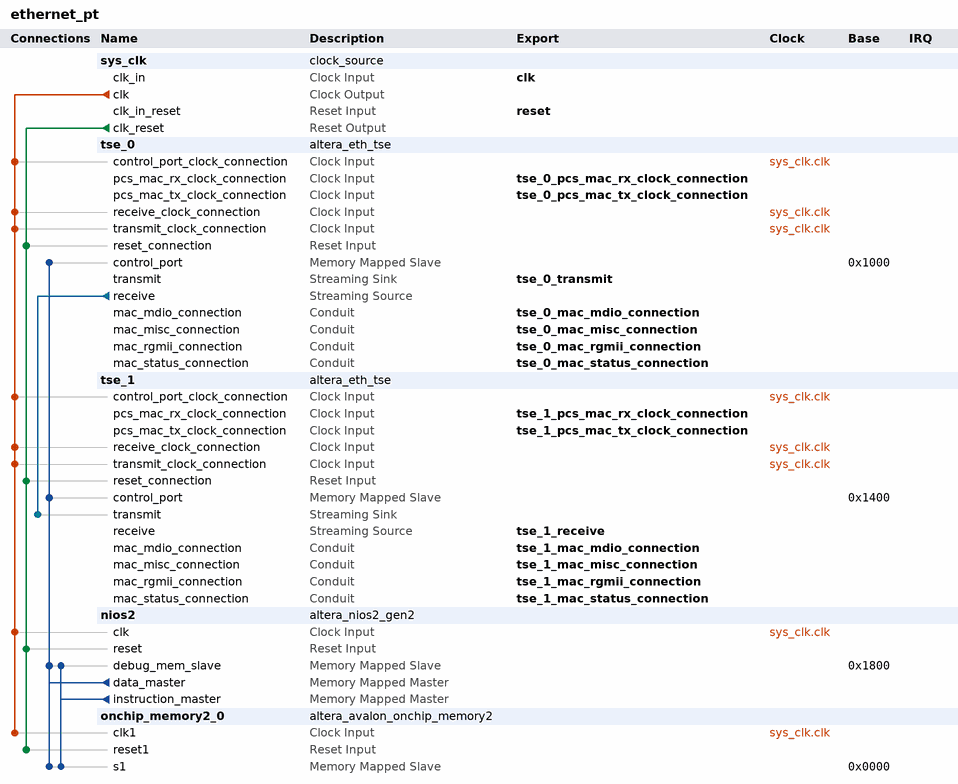
[diagram p0: system contents]
# Platform Designer (Qsys) system ethernet_pt, Cyclone IV E EP4CE115F29C7
# Parameters at their usual value, and those the tool derives, are not listed.
package require -exact qsys 18.1
create_system ethernet_pt
set_project_property DEVICE_FAMILY {Cyclone IV E}
set_project_property DEVICE EP4CE115F29C7

add_instance sys_clk clock_source 18.1
set_instance_parameter_value sys_clk clockFrequency 100000000

add_instance tse_0 altera_eth_tse 18.1
set_instance_parameter_value tse_0 XCVR_RCFG_JTAG_ENABLE 0
set_instance_parameter_value tse_0 XCVR_SET_CAPABILITY_REG_ENABLE 0
set_instance_parameter_value tse_0 XCVR_SET_CSR_SOFT_LOGIC_ENABLE 0
set_instance_parameter_value tse_0 XCVR_SET_PRBS_SOFT_LOGIC_ENABLE 0
set_instance_parameter_value tse_0 XCVR_SET_USER_IDENTIFIER 0
set_instance_parameter_value tse_0 core_variation SMALL_MAC_GIGE
set_instance_parameter_value tse_0 eg_addr 8
set_instance_parameter_value tse_0 enable_hd_logic false
set_instance_parameter_value tse_0 enable_mac_flow_ctrl false
set_instance_parameter_value tse_0 enable_magic_detect false
set_instance_parameter_value tse_0 enable_shift16 true
set_instance_parameter_value tse_0 ifGMII RGMII
set_instance_parameter_value tse_0 ing_addr 8
set_instance_parameter_value tse_0 mdio_clk_div 40
set_instance_parameter_value tse_0 stat_cnt_ena false
set_instance_parameter_value tse_0 transceiver_type NONE

add_instance tse_1 altera_eth_tse 18.1
set_instance_parameter_value tse_1 XCVR_RCFG_JTAG_ENABLE 0
set_instance_parameter_value tse_1 XCVR_SET_CAPABILITY_REG_ENABLE 0
set_instance_parameter_value tse_1 XCVR_SET_CSR_SOFT_LOGIC_ENABLE 0
set_instance_parameter_value tse_1 XCVR_SET_PRBS_SOFT_LOGIC_ENABLE 0
set_instance_parameter_value tse_1 XCVR_SET_USER_IDENTIFIER 0
set_instance_parameter_value tse_1 core_variation SMALL_MAC_GIGE
set_instance_parameter_value tse_1 eg_addr 8
set_instance_parameter_value tse_1 enable_hd_logic false
set_instance_parameter_value tse_1 enable_mac_flow_ctrl false
set_instance_parameter_value tse_1 enable_magic_detect false
set_instance_parameter_value tse_1 enable_shift16 true
set_instance_parameter_value tse_1 ifGMII RGMII
set_instance_parameter_value tse_1 ing_addr 8
set_instance_parameter_value tse_1 mdio_clk_div 40
set_instance_parameter_value tse_1 stat_cnt_ena false
set_instance_parameter_value tse_1 transceiver_type NONE

add_instance nios2 altera_nios2_gen2 18.1
set_instance_parameter_value nios2 dcache_size 2048
set_instance_parameter_value nios2 exceptionSlave onchip_memory2_0.s1
set_instance_parameter_value nios2 icache_size 4096
set_instance_parameter_value nios2 impl Tiny
set_instance_parameter_value nios2 resetSlave onchip_memory2_0.s1

add_instance onchip_memory2_0 altera_avalon_onchip_memory2 18.1
set_instance_parameter_value onchip_memory2_0 dataWidth 32
set_instance_parameter_value onchip_memory2_0 dualPort false
set_instance_parameter_value onchip_memory2_0 initMemContent true
set_instance_parameter_value onchip_memory2_0 initializationFileName onchip_mem.hex
set_instance_parameter_value onchip_memory2_0 memorySize 4096

# connections
add_connection sys_clk.clk nios2.clk clock
add_connection sys_clk.clk onchip_memory2_0.clk1 clock
add_connection sys_clk.clk tse_0.control_port_clock_connection clock
add_connection sys_clk.clk tse_0.receive_clock_connection clock
add_connection sys_clk.clk tse_0.transmit_clock_connection clock
add_connection sys_clk.clk tse_1.control_port_clock_connection clock
add_connection sys_clk.clk tse_1.receive_clock_connection clock
add_connection sys_clk.clk tse_1.transmit_clock_connection clock
add_connection sys_clk.clk_reset nios2.reset reset
add_connection sys_clk.clk_reset onchip_memory2_0.reset1 reset
add_connection sys_clk.clk_reset tse_0.reset_connection reset
add_connection sys_clk.clk_reset tse_1.reset_connection reset
add_connection nios2.data_master nios2.debug_mem_slave avalon
set_connection_parameter_value nios2.data_master/nios2.debug_mem_slave baseAddress 0x1800
add_connection nios2.data_master onchip_memory2_0.s1 avalon
set_connection_parameter_value nios2.data_master/onchip_memory2_0.s1 baseAddress 0x0000
add_connection nios2.data_master tse_0.control_port avalon
set_connection_parameter_value nios2.data_master/tse_0.control_port baseAddress 0x1000
add_connection nios2.data_master tse_1.control_port avalon
set_connection_parameter_value nios2.data_master/tse_1.control_port baseAddress 0x1400
add_connection nios2.instruction_master nios2.debug_mem_slave avalon
set_connection_parameter_value nios2.instruction_master/nios2.debug_mem_slave baseAddress 0x1800
add_connection nios2.instruction_master onchip_memory2_0.s1 avalon
set_connection_parameter_value nios2.instruction_master/onchip_memory2_0.s1 baseAddress 0x0000
add_connection tse_0.receive tse_1.transmit avalon_streaming

# exported interfaces
add_interface clk clock sink
set_interface_property clk EXPORT_OF sys_clk.clk_in
add_interface reset reset sink
set_interface_property reset EXPORT_OF sys_clk.clk_in_reset
add_interface tse_0_mac_mdio_connection conduit end
set_interface_property tse_0_mac_mdio_connection EXPORT_OF tse_0.mac_mdio_connection
add_interface tse_0_mac_misc_connection conduit end
set_interface_property tse_0_mac_misc_connection EXPORT_OF tse_0.mac_misc_connection
add_interface tse_0_mac_rgmii_connection conduit end
set_interface_property tse_0_mac_rgmii_connection EXPORT_OF tse_0.mac_rgmii_connection
add_interface tse_0_mac_status_connection conduit end
set_interface_property tse_0_mac_status_connection EXPORT_OF tse_0.mac_status_connection
add_interface tse_0_pcs_mac_rx_clock_connection clock sink
set_interface_property tse_0_pcs_mac_rx_clock_connection EXPORT_OF tse_0.pcs_mac_rx_clock_connection
add_interface tse_0_pcs_mac_tx_clock_connection clock sink
set_interface_property tse_0_pcs_mac_tx_clock_connection EXPORT_OF tse_0.pcs_mac_tx_clock_connection
add_interface tse_0_transmit avalon_streaming sink
set_interface_property tse_0_transmit EXPORT_OF tse_0.transmit
add_interface tse_1_mac_mdio_connection conduit end
set_interface_property tse_1_mac_mdio_connection EXPORT_OF tse_1.mac_mdio_connection
add_interface tse_1_mac_misc_connection conduit end
set_interface_property tse_1_mac_misc_connection EXPORT_OF tse_1.mac_misc_connection
add_interface tse_1_mac_rgmii_connection conduit end
set_interface_property tse_1_mac_rgmii_connection EXPORT_OF tse_1.mac_rgmii_connection
add_interface tse_1_mac_status_connection conduit end
set_interface_property tse_1_mac_status_connection EXPORT_OF tse_1.mac_status_connection
add_interface tse_1_pcs_mac_rx_clock_connection clock sink
set_interface_property tse_1_pcs_mac_rx_clock_connection EXPORT_OF tse_1.pcs_mac_rx_clock_connection
add_interface tse_1_pcs_mac_tx_clock_connection clock sink
set_interface_property tse_1_pcs_mac_tx_clock_connection EXPORT_OF tse_1.pcs_mac_tx_clock_connection
add_interface tse_1_receive avalon_streaming source
set_interface_property tse_1_receive EXPORT_OF tse_1.receive

set_interconnect_requirement {$system} qsys_mm.clockCrossingAdapter HANDSHAKE
set_interconnect_requirement {$system} qsys_mm.enableEccProtection FALSE
set_interconnect_requirement {$system} qsys_mm.insertDefaultSlave FALSE
set_interconnect_requirement {$system} qsys_mm.maxAdditionalLatency 1

save_system ethernet_pt.qsys
